# Altium schematic sheet balance car.SchDoc: BalanceCar
size A4; CheckedBy: SchumyHao; Author: SchumyHao; DrawnBy: SchumyHao; DocumentNumber: 1; Revision: V01; SheetNumber: 1; SheetTotal: 7; ProjectName: BalanceCar
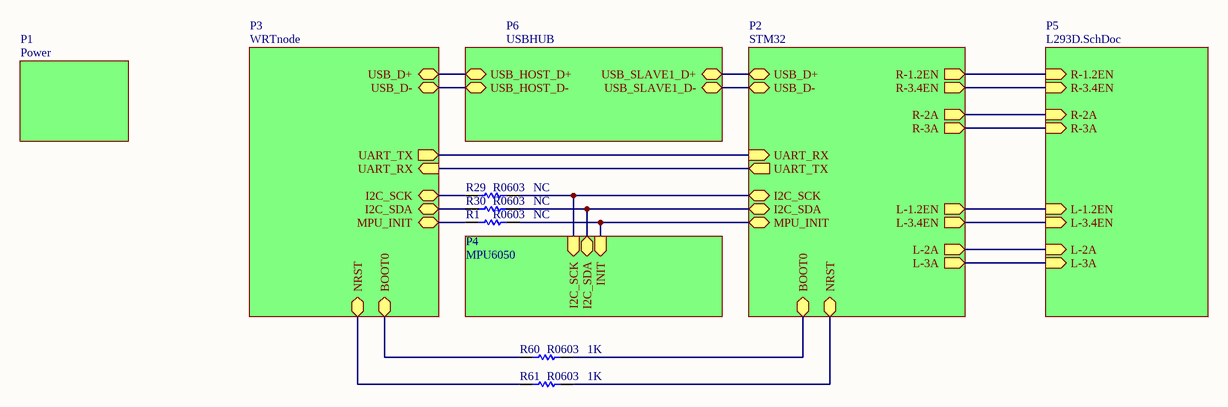
[diagram p0: balance car.SchDoc]

## Parts
R1  R0603  value NC  [R0603N]
R29  R0603  value NC  [R0603N]
R30  R0603  value NC  [R0603N]
R60  R0603  value 1K  [R0603N]
R61  R0603  value 1K  [R0603N]

## Sub-sheets
P1 = Power: no entries
P2 = STM32: UART_TX (out), UART_RX (in), USB_D+ (bidir), USB_D- (bidir), I2C_SCK (bidir), I2C_SDA (bidir), L-3A (out), L-2A (out), L-3.4EN (out), L-1.2EN (out), R-3A (out), R-2A (out), R-1.2EN (out), R-3.4EN (out), MPU_INIT (bidir), BOOT0, NRST
P3 = WRTnode: UART_TX (out), UART_RX (in), USB_D+ (bidir), USB_D- (bidir), I2C_SCK (bidir), I2C_SDA (bidir), MPU_INIT (bidir), BOOT0, NRST
P4 = MPU6050: I2C_SCK (in), I2C_SDA (bidir), INIT (in)
P5 = L293D.SchDoc: R-1.2EN (in), R-3.4EN (in), R-2A (in), R-3A (in), L-1.2EN (in), L-3.4EN (in), L-2A (in), L-3A (in)
P6 = USBHUB: USB_HOST_D+ (bidir), USB_HOST_D- (bidir), USB_SLAVE1_D+ (bidir), USB_SLAVE1_D- (bidir)

## Nets
NetR1_1: R1.1 ; sheet P3/MPU_INIT
NetR1_2: R1.2 ; sheet P2/MPU_INIT, sheet P4/INIT
NetR29_1: R29.1 ; sheet P3/I2C_SCK
NetR29_2: R29.2 ; sheet P2/I2C_SCK, sheet P4/I2C_SCK
NetR30_1: R30.1 ; sheet P3/I2C_SDA
NetR30_2: R30.2 ; sheet P2/I2C_SDA, sheet P4/I2C_SDA
NetR60_1: R60.1 ; sheet P3/BOOT0
NetR60_2: R60.2 ; sheet P2/BOOT0
NetR61_1: R61.1 ; sheet P3/NRST
NetR61_2: R61.2 ; sheet P2/NRST
(unnamed): sheet P2/UART_TX, sheet P3/UART_RX
(unnamed): sheet P2/UART_RX, sheet P3/UART_TX
(unnamed): sheet P2/USB_D+, sheet P6/USB_SLAVE1_D+
(unnamed): sheet P2/USB_D-, sheet P6/USB_SLAVE1_D-
(unnamed): sheet P2/L-3A, sheet P5/L-3A
(unnamed): sheet P2/L-2A, sheet P5/L-2A
(unnamed): sheet P2/L-3.4EN, sheet P5/L-3.4EN
(unnamed): sheet P2/L-1.2EN, sheet P5/L-1.2EN
(unnamed): sheet P2/R-3A, sheet P5/R-3A
(unnamed): sheet P2/R-2A, sheet P5/R-2A
(unnamed): sheet P2/R-1.2EN, sheet P5/R-1.2EN
(unnamed): sheet P2/R-3.4EN, sheet P5/R-3.4EN
(unnamed): sheet P3/USB_D+, sheet P6/USB_HOST_D+
(unnamed): sheet P3/USB_D-, sheet P6/USB_HOST_D-

## Notes on the sheet
- Title
- Size:
- Date:
- A4
- Number:
- Time:
- Revision:
- Sheet
- of
- File:

## Library data of the parts
R1 R29 R30 R60 R61 = Res Semi: Semiconductor Resistor